# EAGLE design Motor (EAGLE 7.6.0)
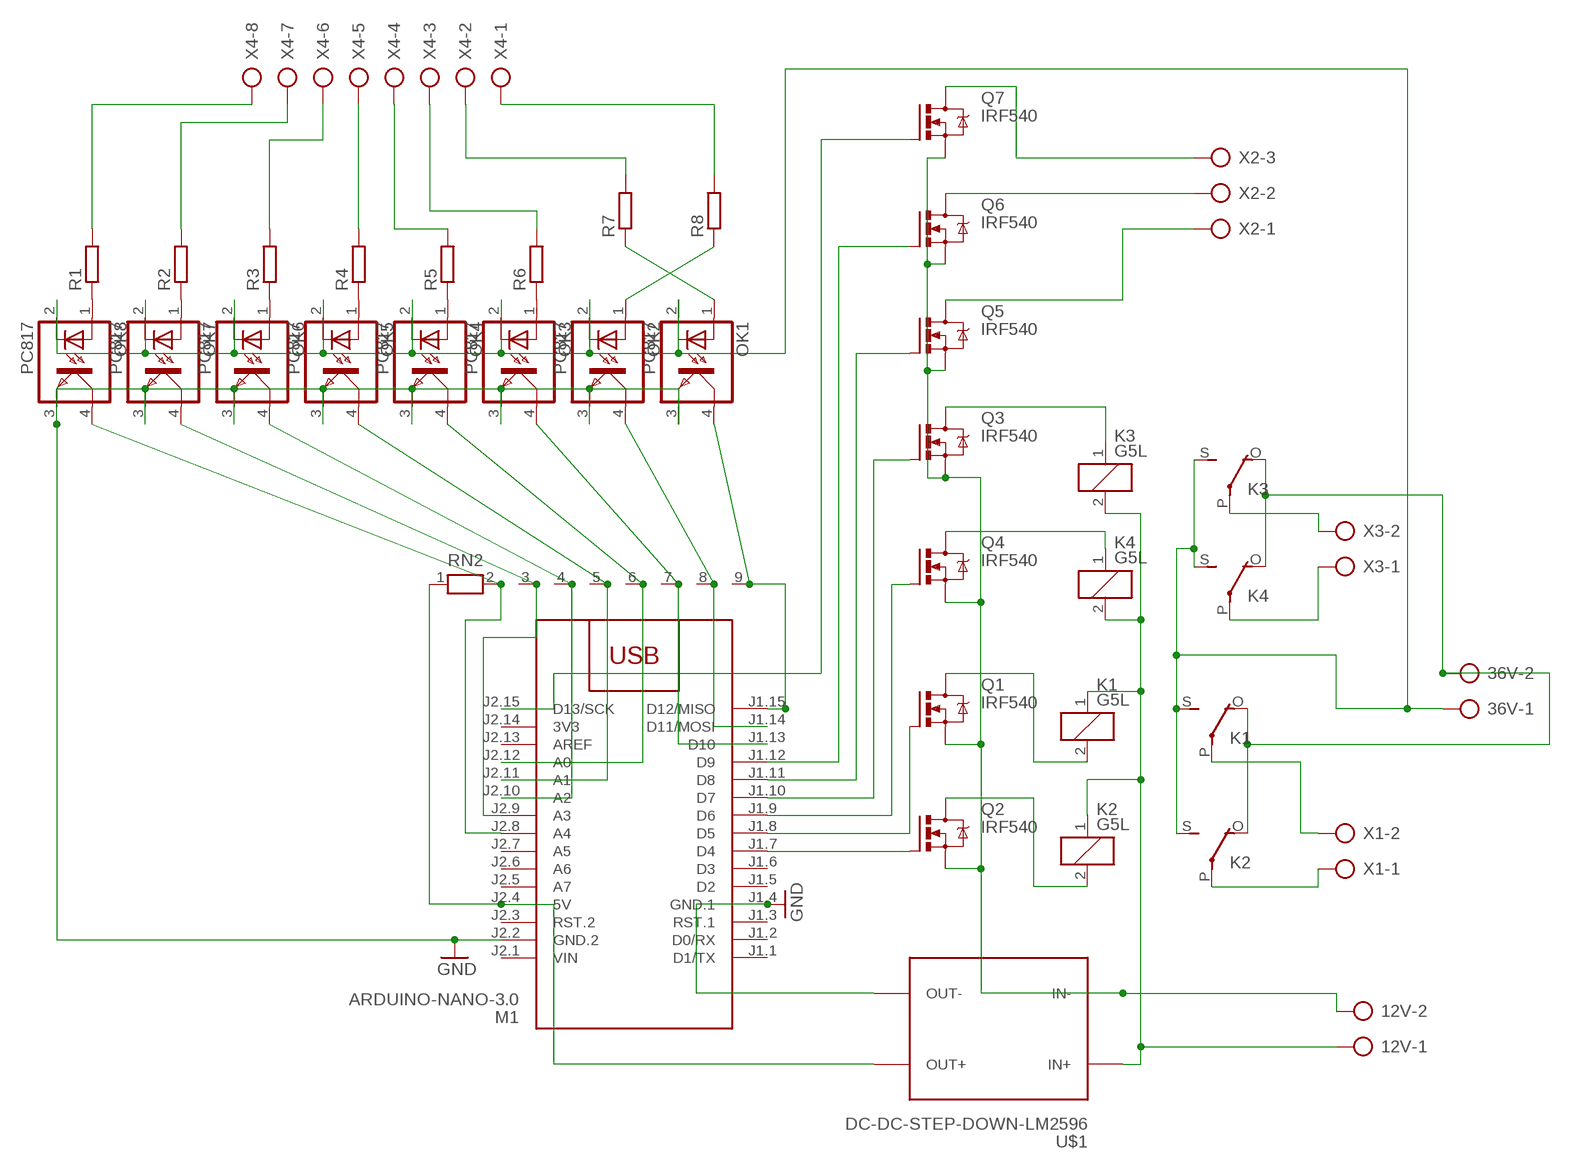
[diagram p0: schematic, sheet 1]

## Parts
12V  AK300/2  [AK300/2]
36V  AK300/2  [AK300/2]
K1  G5L  [G5LE]
K2  G5L  [G5LE]
K3  G5L  [G5LE]
K4  G5L  [G5LE]
M1  ARDUINO-NANO-3.0  [ARDUINO-NANO-3.0]
OK1  PC817  [DIL04]
OK2  PC817  [DIL04]
OK3  PC817  [DIL04]
OK4  PC817  [DIL04]
OK5  PC817  [DIL04]
OK6  PC817  [DIL04]
OK7  PC817  [DIL04]
OK8  PC817  [DIL04]
Q1  IRF540  [TO220BV]
Q2  IRF540  [TO220BV]
Q3  IRF540  [TO220BV]
Q4  IRF540  [TO220BV]
Q5  IRF540  [TO220BV]
Q6  IRF540  [TO220BV]
Q7  IRF540  [TO220BV]
R1  R-EU_0204/7  [0204/7]
R2  R-EU_0204/7  [0204/7]
R3  R-EU_0204/7  [0204/7]
R4  R-EU_0204/7  [0204/7]
R5  R-EU_0204/7  [0204/7]
R6  R-EU_0204/7  [0204/7]
R7  R-EU_0204/7  [0204/7]
R8  R-EU_0204/7  [0204/7]
RN2  RN08  [RN-9]
U$1  DC-DC-STEP-DOWN-LM2596  [DC-DC-STEP-DOWN-LM2596]
X1  AK300/2  [AK300/2]
X2  AK300/3  [AK300/3]
X3  AK300/2  [AK300/2]
X4  AK300/8  [AK300/8]

## Nets
+36V: 36V.2 K1.O(2:O) K2.O(2:O) K3.O(2:O) K4.O(2:O)
-36V: 36V.1 K1.S(2:S) K2.S(2:S) K3.S(2:S) K4.S(2:S) OK1.2(C) OK2.2(C) OK3.2(C) OK4.2(C) OK5.2(C) OK6.2(C) OK7.2(C) OK8.2(C)
GND: M1.J1.4(GND.1) M1.J2.2(GND.2) OK1.3(EMIT) OK2.3(EMIT) OK3.3(EMIT) OK4.3(EMIT) OK5.3(EMIT) OK6.3(EMIT) OK7.3(EMIT) OK8.3(EMIT) U$1.OUT-
GND12: 12V.2 Q1.S Q2.S Q3.S Q4.S Q5.S Q6.S Q7.S U$1.IN-
N$1: Q7.D X2.3
N$2: M1.J1.15(D12/MISO) OK1.4(COL) RN2.9
N$3: K2.2 Q2.D
N$4: K1.2 Q1.D
N$5: M1.J2.15(D13/SCK) Q7.G
N$6: M1.J2.4(5V) RN2.1 U$1.OUT+
N$8: M1.J1.7(D4) Q2.G
N$9: 12V.1 K1.1 K2.1 K3.2 K4.2 U$1.IN+
N$10: M1.J1.8(D5) Q1.G
N$11: K2.P(2:P) X1.1
N$12: K1.P(2:P) X1.2
N$13: Q5.D X2.1
N$14: OK2.1(A) R8.1
N$15: K3.P(2:P) X3.2
N$16: K4.P(2:P) X3.1
N$17: Q6.D X2.2
N$18: K3.1 Q3.D
N$19: K4.1 Q4.D
N$20: M1.J1.9(D6) Q4.G
N$21: M1.J1.10(D7) Q3.G
N$22: M1.J2.8(A4) OK8.4(COL) RN2.2
N$23: OK1.1(A) R7.1
N$24: M1.J1.11(D8) Q5.G
N$25: M1.J1.12(D9) Q6.G
N$26: M1.J2.10(A2) OK6.4(COL) RN2.4
N$27: M1.J2.11(A1) OK5.4(COL) RN2.5
N$28: M1.J2.12(A0) OK4.4(COL) RN2.6
N$29: M1.J2.9(A3) OK7.4(COL) RN2.3
N$33: OK8.1(A) R1.1
N$34: OK7.1(A) R2.1
N$35: OK6.1(A) R3.1
N$36: OK5.1(A) R4.1
N$37: OK4.1(A) R5.1
N$38: OK3.1(A) R6.1
N$42: R1.2 X4.8
N$43: R2.2 X4.7
N$44: R3.2 X4.6
N$45: R4.2 X4.5
N$46: R5.2 X4.4
N$47: R6.2 X4.3
N$48: R7.2 X4.2
N$49: R8.2 X4.1
N$52: M1.J1.13(D10) OK3.4(COL) RN2.7
N$53: M1.J1.14(D11/MOSI) OK2.4(COL) RN2.8
Unconnected: M1.J1.1(D1/TX) M1.J1.2(D0/RX) M1.J1.3(RST.1) M1.J1.5(D2) M1.J1.6(D3) M1.J2.3(RST.2) M1.J2.5(A7) M1.J2.6(A6) M1.J2.7(A5) M1.J2.13(AREF)

## Power pins joined to a net without a drawn wire
3V3: M1.J2.14(3V3)
VIN: M1.J2.1(VIN)

## Library data of the parts
12V 36V X1 X3 = con-ptr500:AK300/2: CONNECTOR; OC_FARNELL: unknown; OC_NEWARK: unknown
K1-K4 = relay:G5L: RELAY 1 x switch, 10 A/120 V AC, 8 A/30 V ADC, Omron; OC_FARNELL: unknown; OC_NEWARK: unknown
M1 = diy-modules:ARDUINO-NANO-3.0: Arduino Nano 3.0 and compatible devices More details available here: https://www.arduino.cc/en/Main/ArduinoBoardNano Click here to find device on ebay.com <http://www.ebay.com/sch/arduino+nano>
OK1-OK8 = optocoupler:PC817: SHARP OPTO COUPLER; MPN: PC817X4J000F; OC_FARNELL: 9707727; OC_NEWARK: 97K7059
Q1-Q7 = transistor-power:IRF540: HEXFET Power MOSFET
R1-R8 = rcl:R-EU_: RESISTOR, European symbol
RN2 = resistor-net:RN08: RESISTOR NETWORK; OC_FARNELL: unknown; OC_NEWARK: unknown
U$1 = diy-modules:DC-DC-STEP-DOWN-LM2596: DC/DC Step-Down Regulator based on LM2596-ADJ chip LM2596 datasheet available here: http://www.ti.com/lit/ds/symlink/lm2596.pdf Click here to find device on ebay.com <http://www.ebay.com/sch/lm2596+power+regulator>
X2 = con-ptr500:AK300/3: CONNECTOR; OC_FARNELL: unknown; OC_NEWARK: unknown
X4 = con-ptr500:AK300/8: CONNECTOR; OC_FARNELL: unknown; OC_NEWARK: unknown

## Board
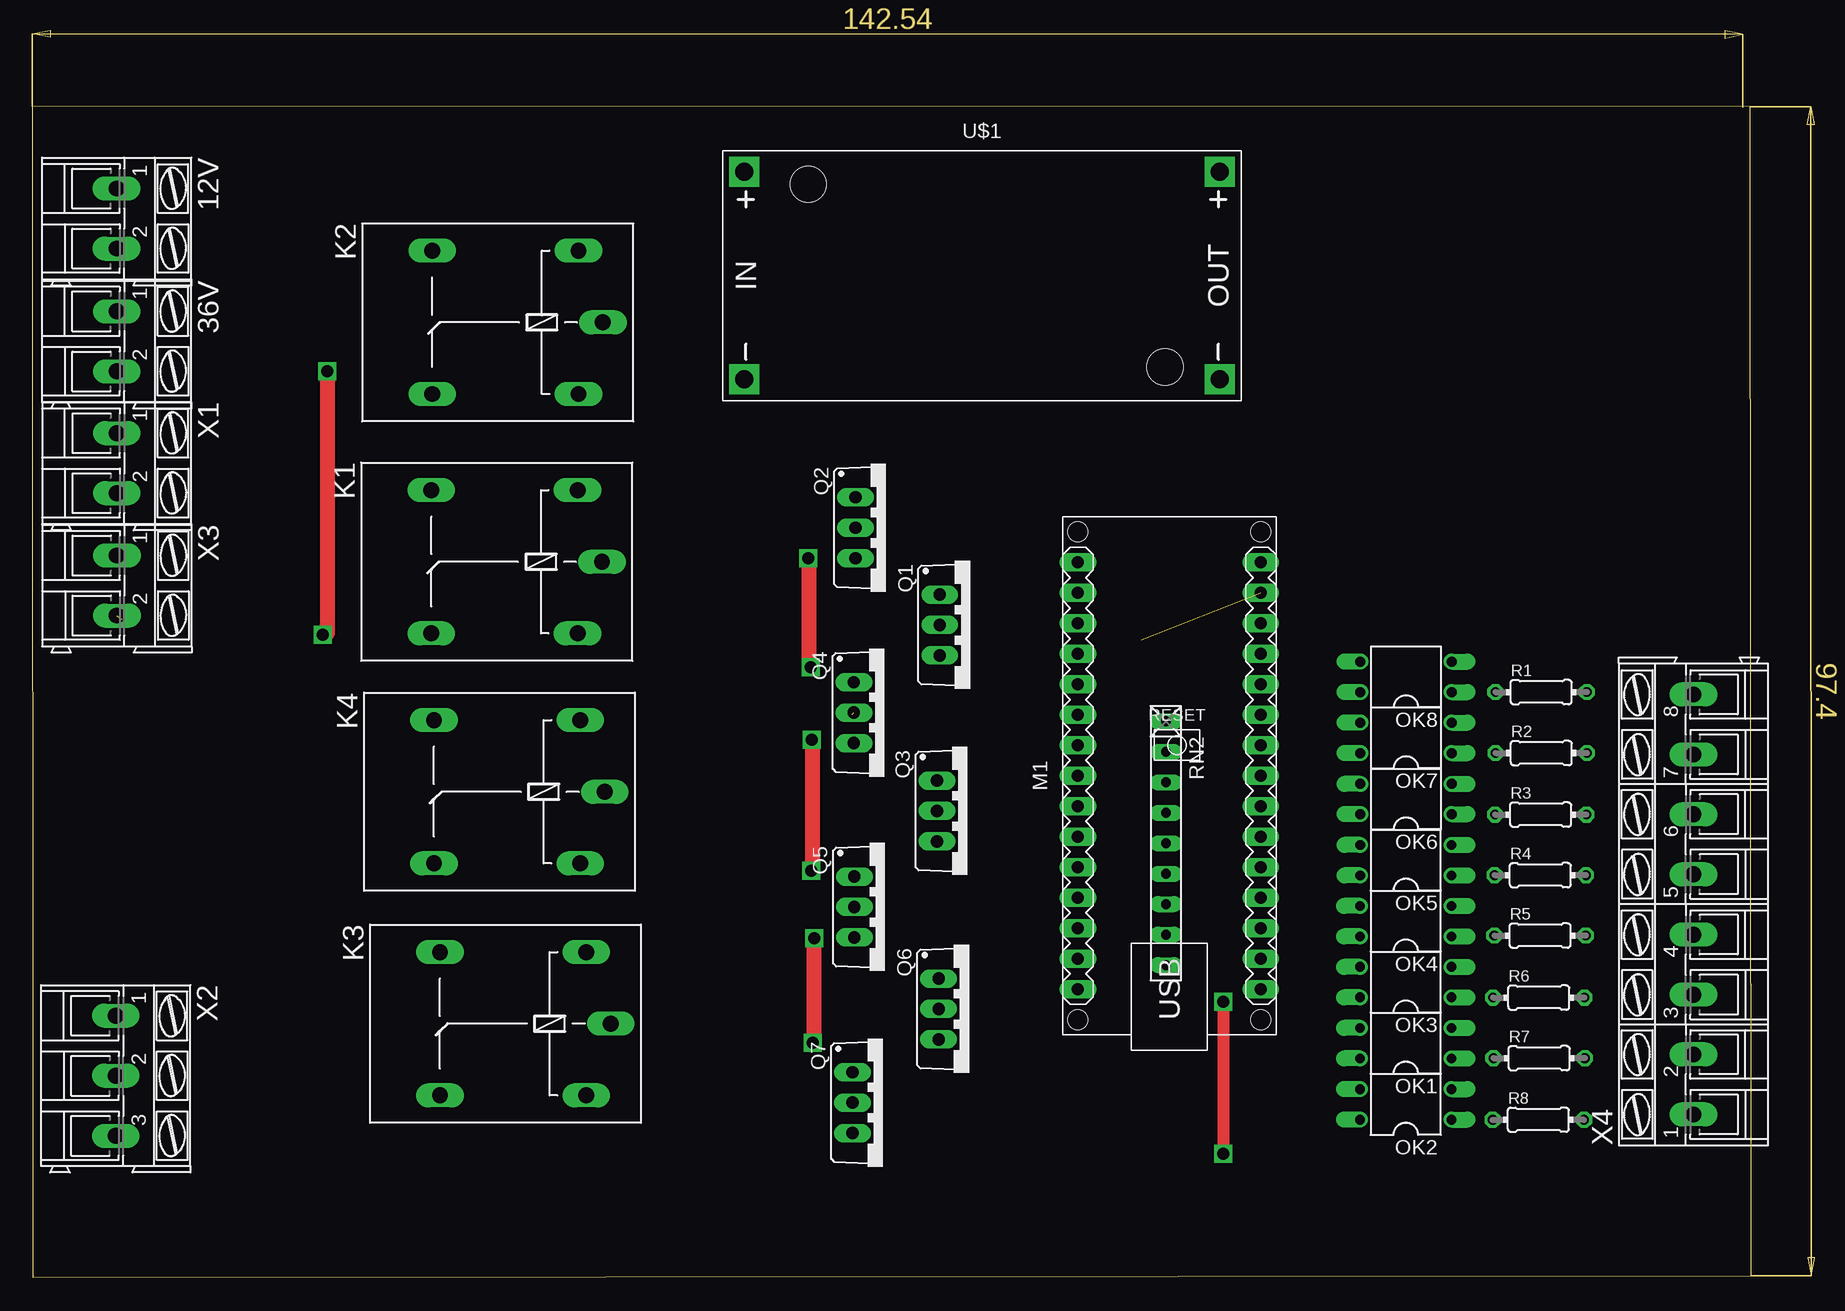
[diagram p1: board, top side]
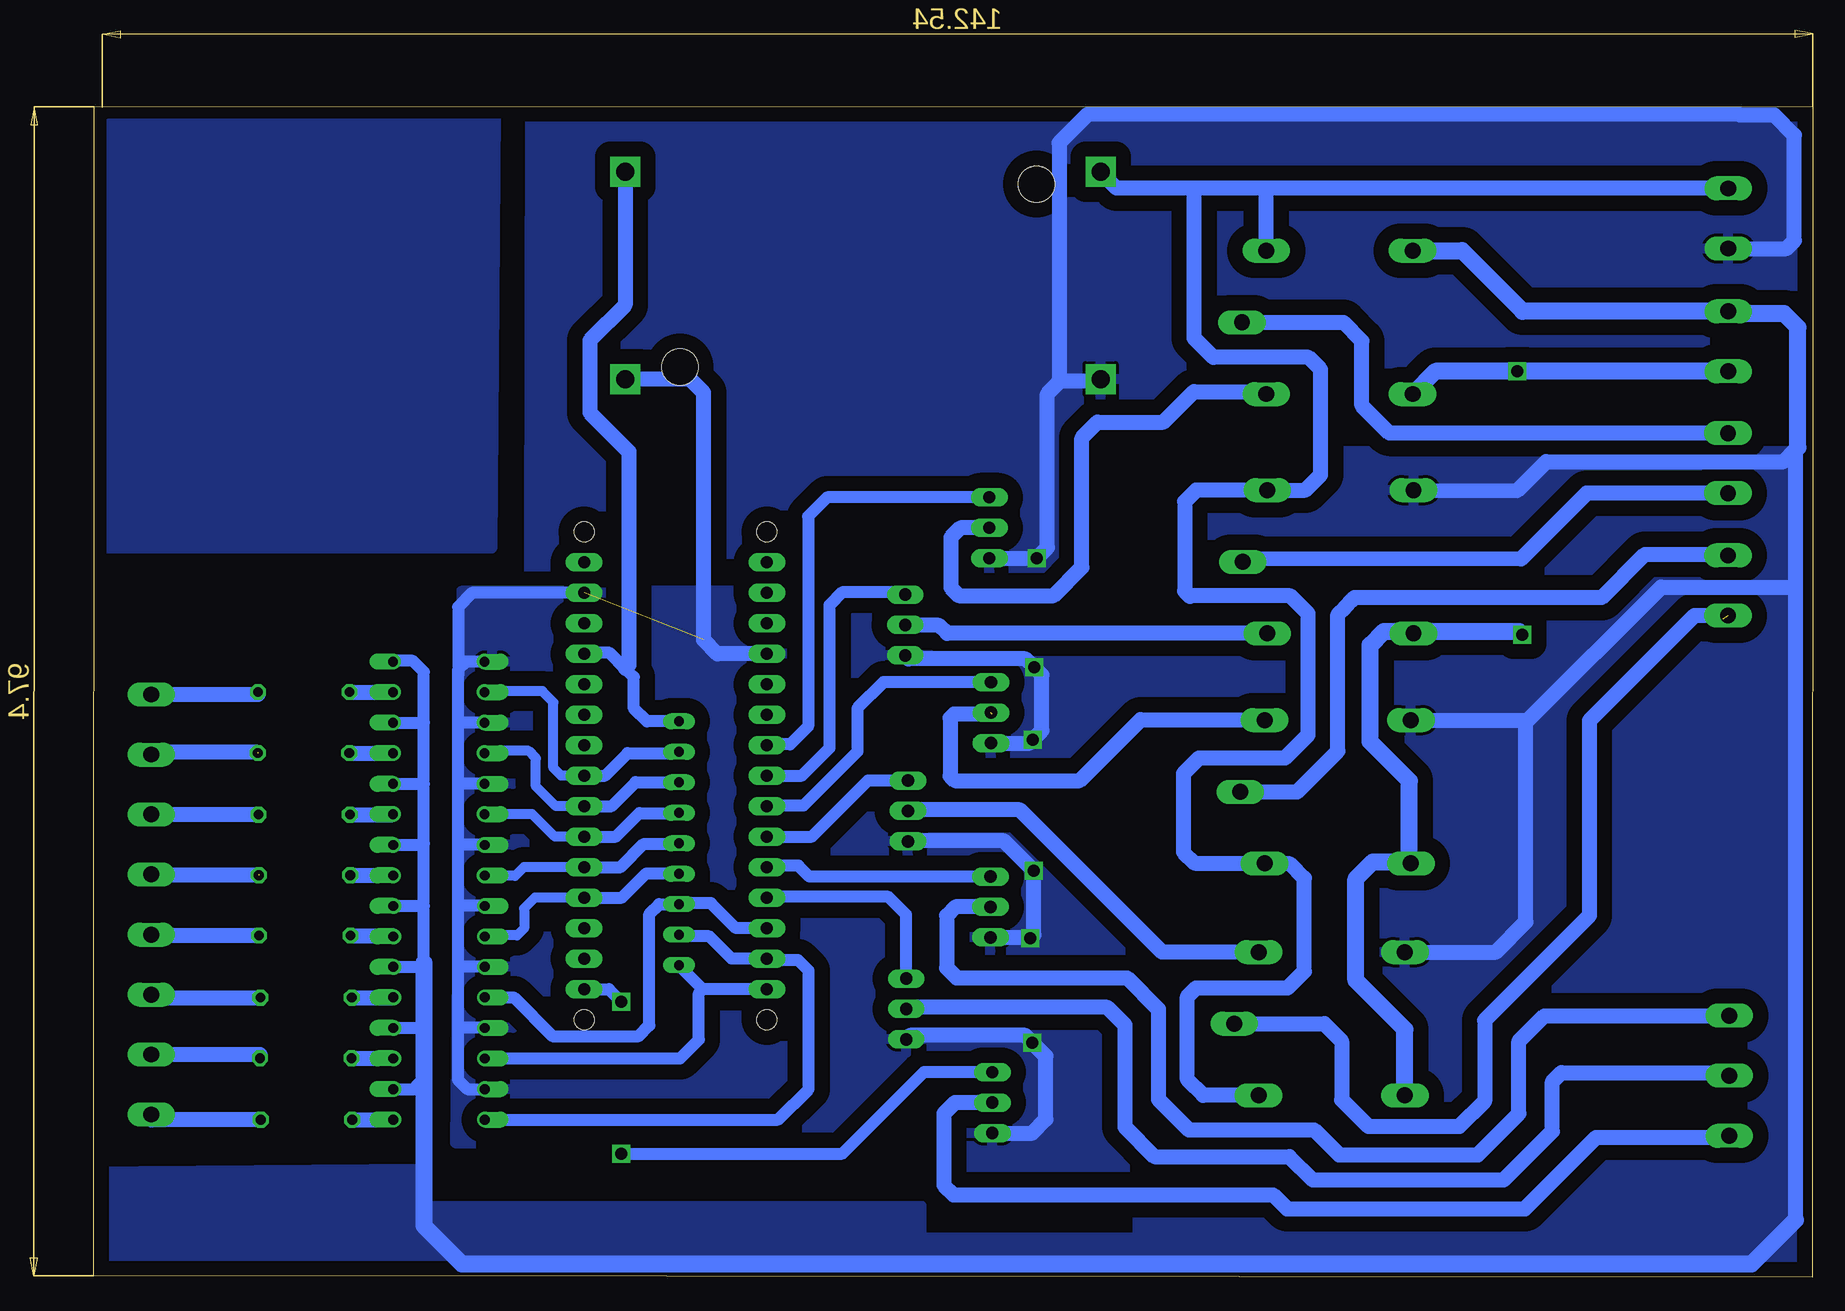
[diagram p2: board, bottom side, seen from below]

Size 143.23 x 97.57 mm. Coordinates in mm from the lower left corner, seen from the top.
Outline: 0.05,0 143.23,0.13 143.18,97.53 0,97.57 0.05,0
Copper layers (1*16): Top 0.035mm / dielectric 1.5mm / Bottom 0.035mm
Design rules "default": minimum track width 10mil, minimum drill 24mil, track to track 8mil, track to pad 8mil, pad to pad 8mil, via to via 8mil, smd to smd 8mil, copper to edge 40mil, drill to drill 8mil, minimum pad ring 10mil, minimum via ring 8mil, stop-mask expansion 4mil, vias tented up to drill 0mil, thermal gap 10mil

### Footprints (pad centres in the part's own frame; a part is rotated, then mirrored left to right if it is on the bottom)
AK300/2 = drill 1.321 long: 1 -2.515,0; 2 2.489,0
G5LE = drill 1.321 long: 1 -7.493,-5.969; 2 -7.493,5.969; O 4.699,5.969; P -9.525,0; S 4.699,-5.969
ARDUINO-NANO-3.0 = drill 1 pad 1.524 long: J1.1 17.78,7.62; J1.2 15.24,7.62; J1.3 12.7,7.62; J1.4 10.16,7.62; J1.5 7.62,7.62; J1.6 5.08,7.62; J1.7 2.54,7.62; J1.8 0,7.62; J1.9 -2.54,7.62; J1.10 -5.08,7.62; J1.11 -7.62,7.62; J1.12 -10.16,7.62; J1.13 -12.7,7.62; J1.14 -15.24,7.62; J1.15 -17.78,7.62; J2.1 17.78,-7.62; J2.2 15.24,-7.62; J2.3 12.7,-7.62; J2.4 10.16,-7.62; J2.5 7.62,-7.62; J2.6 5.08,-7.62; J2.7 2.54,-7.62; J2.8 0,-7.62; J2.9 -2.54,-7.62; J2.10 -5.08,-7.62; J2.11 -7.62,-7.62; J2.12 -10.16,-7.62; J2.13 -12.7,-7.62; J2.14 -15.24,-7.62; J2.15 -17.78,-7.62 | hole 1.651: -20.32,7.62; -20.32,-7.62; 20.32,-7.62; 20.32,7.62
DIL04 = drill 0.813 offset: 1 -1.27,-3.81; 2 1.27,-3.81; 3 1.27,3.81; 4 -1.27,3.81
TO220BV = drill 1.016 long: D 0,-2.54; G -2.54,-2.54; S 2.54,-2.54
0204/7 = drill 0.813 octagon: 1 -3.81,0; 2 3.81,0
RN-9 = drill 0.813 long: 1 -10.16,0; 2 -7.62,0; 3 -5.08,0; 4 -2.54,0; 5 0,0; 6 2.54,0; 7 5.08,0; 8 7.62,0; 9 10.16,0
DC-DC-STEP-DOWN-LM2596 = drill 1.5 pad 2.5 square: IN+ -19.812,8.636; IN- -19.812,-8.636; OUT+ 19.812,8.636; OUT- 19.812,-8.636 | hole 3: -14.478,7.62; 15.24,-7.62
AK300/3 = drill 1.321 long: 1 -5.004,0; 2 0,0; 3 5.004,0
AK300/8 = drill 1.321 long: 1 -17.501,0; 2 -12.497,0; 3 -7.518,0; 4 -2.515,0; 5 2.515,0; 6 7.518,0; 7 12.497,0; 8 17.501,0

### Placement (x,y rotation side)
12V  7.03,88.21 270 top
36V  7.03,77.98 270 top
K1  37.95,59.62 180 top
K2  38.03,79.57 180 top
K3  38.67,21.12 180 top
K4  38.17,40.45 180 top
M1  94.76,41.79 90 top
OK1  114.46,19.5 90 top
OK2  114.46,14.4 90 top
OK3  114.46,24.59 90 top
OK4  114.46,29.67 90 top
OK5  114.47,34.75 90 top
OK6  114.48,39.85 90 top
OK7  114.48,44.94 90 top
OK8  114.48,50.02 90 top
Q1  78.16,54.35 270 top
Q2  71.14,62.45 270 top
Q3  77.93,38.85 270 top
Q4  71.01,47.05 270 top
Q5  71.05,30.85 270 top
Q6  78.07,22.35 270 top
Q7  70.89,14.55 270 top
R1  125.74,48.76 0 top
R2  125.75,43.68 0 top
R3  125.7,38.55 0 top
R4  125.67,33.5 0 top
R5  125.65,28.47 0 top
R6  125.54,23.3 0 top
R7  125.57,18.25 0 top
R8  125.51,13.12 0 top
RN2  94.47,36.16 270 top
U$1  79.15,83.47 0 top
X1  7.04,67.83 270 top
X2  6.95,16.79 270 top
X3  7.05,57.63 270 top
X4  138.44,31.06 90 top

### Tracks (layer width: path | path; a pad name or v marks a point on that pad's centre or on a via)
+36V  (via drill 1)
  Top 1.27: v24.2,53.53 24.46,53.53 24.62,53.69 24.62,75.47 v24.6,75.49
  Bottom 1.27: 33.6,34.61 K4.O | 33.41,53.81 K1.O | 24.48,53.81 v24.2,53.53 | v24.6,75.49 24.11,75.49
  Bottom 1.422: 36V.2 24.11,75.49 | v24.6,75.49 31.44,75.49 K2.O | K3.O 33.98,20.65 38.06,24.73 38.06,33.19 36.64,34.61 33.6,34.61 33.6,41.36 36.87,44.63 36.87,52.67 35.73,53.81 33.41,53.81 24.48,53.81
-36V
  Bottom 1.016: OK2.2 116.45,15.67 115.91,16.21 115.72,16.4 115.72,20.84 | 115.72,20.84 115.72,26.19 | 115.72,26.19 115.72,30.94 | 115.72,30.94 115.72,36.16 | 115.72,36.16 115.72,41.11 | 115.72,41.11 115.72,46.23 | 115.72,46.23 115.72,50.44 116.65,51.37 118.21,51.37 OK8.2 | OK7.2 115.74,46.21 115.72,46.23 | OK6.2 115.73,41.12 115.72,41.11 | OK5.2 115.86,36.02 115.72,36.16 | OK4.2 115.72,30.94 | OK3.2 116.05,25.86 115.72,26.19 | OK1.2 115.79,20.77 115.72,20.84
  Bottom 1.27: K1.S 24.62,65.56 22.21,67.96 2.42,67.96 1.44,68.94 | 1.44,68.94 1.23,69.15 | 6.84,80.3 36V.1 | K4.S 23.74,46.39 | 23.74,46.39 12.61,57.52 1.57,57.52 1.44,57.39 | K3.S 26.4,27.09 23.89,29.6 23.89,46.24 23.74,46.39 | 1.44,68.94 1.44,57.39 | 1.44,57.39 1.44,4.76 | 116.2,15.92 115.91,16.21
  Bottom 1.422: 36V.1 24.16,80.49 29.2,85.54 K2.S | 1.23,69.15 1.23,79.16 2.38,80.3 6.84,80.3 | 115.72,26.19 115.72,4.29 112.55,1.12 5.08,1.12 1.44,4.76
  pour Bottom (isolate 1.27): 0.11,56.16 0.11,-1.71 144.47,-1.71 144.29,8.81 115.5,9.08 115.6,5.97 74.26,5.97 74.26,3.34 56.25,3.34 56.25,68.87 0.12,68.87 0.12,55.98
A
  pour Bottom: 109.76,97.23 109.73,97.23 110.03,60.71 143.12,60.71 143.11,97.38 109.71,97.38
GND  (1 unrouted)
  Bottom 1.016: 112.89,50.1 112.89,50.6 112.2,51.29 OK8.3 110.62,51.24 | 112.89,50.1 112.89,46.3 | 112.89,46.3 112.89,41.42 | 112.89,41.42 112.89,35.85 | 112.89,35.85 112.89,31.03 | 112.89,31.03 112.89,25.69 | 112.89,25.69 112.89,20.7 | 112.89,20.7 112.89,16.46 112.11,15.68 OK2.3 | OK7.3 112.8,46.21 112.89,46.3 | OK6.3 112.59,41.12 112.89,41.42 | OK5.3 112.72,36.02 112.89,35.85 | OK4.3 112.8,30.94 112.89,31.03 | OK3.3 112.72,25.86 112.89,25.69 | OK1.3 112.82,20.77 112.89,20.7 | M1.J2.2 111.72,57.03 112.88,55.87 112.88,50.11 112.89,50.1
  Bottom 1.27: M1.J1.4 91.26,51.95 92.42,53.11 92.42,73.71 93.53,74.82 98.95,74.82 U$1.OUT-
  pour Bottom (isolate 1.27): 85.2,57.2 112.62,57.2 113.14,11.17 85.69,11.17
GND12  (via drill 1)
  Top 1.27: v64.66,59.91 64.68,59.91 64.72,59.88 64.72,50.98 v64.87,50.82 | v64.98,44.77 64.98,44.82 65,44.84 65,33.97 v64.9,33.87 | v65.17,28.26 65.17,28.3 65.14,28.33 65.14,19.68 v65.02,19.56
  Bottom 1.27: Q7.S 65.03,12.01 63.88,13.15 63.88,18.42 v65.02,19.56 65.61,20.14 75.2,20.14 Q6.S | Q5.S 65.13,28.31 | Q3.S 75.33,36.37 67.4,36.37 v64.9,33.87 64.9,28.54 65.12,28.31 65.13,28.31 | Q1.S 75.34,51.54 65.59,51.54 v64.87,50.82 64.23,50.17 64.23,45.54 65.26,44.51 Q4.S 65.24,44.51 v64.98,44.77 | Q2.S v64.66,59.91 63.78,60.79 63.78,73.61 62.7,74.69 | 62.7,74.69 62.67,74.72 59.45,74.72 U$1.IN- | 62.7,74.69 62.79,74.79 62.79,94.53 60.41,96.91 6.07,96.88 6.03,96.84 3.17,96.84 1.51,95.18 1.51,86.39 2.18,85.72 12V.2 | 65.13,28.31 v65.17,28.26
  pour Bottom (isolate 1.27): 55.62,97.98 106.9,97.98 107.11,2.55 0.3,3.29 -0.66,98.29
N$1
  Bottom 1.27: Q7.D 71.48,14.55 72.4,13.63 72.4,7.68 71.59,6.87 44.95,6.87 43.78,5.7 23.98,5.7 18.03,11.65 7.09,11.65 X2.3
N$2
  Bottom 1.016: M1.J1.15 92.48,24.01 | 92.48,24.01 RN2.9 | OK1.4 94.37,18.23 92.81,19.79 92.81,23.68 92.48,24.01
N$3
  Bottom 1.27: 45.58,73.55 K2.2 45.73,73.81 51.55,73.81 54.1,71.26 59.59,71.26 60.9,69.95 60.9,59.16 63.26,56.8 71.17,56.8 71.82,57.46 71.82,61.64 71.01,62.45 Q2.D
N$4
  Bottom 1.27: K1.2 72.13,53.65 72.8,54.32 75.59,54.32 Q1.D
N$5  (via drill 1)
  Top 1.016: 99.26,23.07 v99.26,22.96 v99.26,10.3
  Bottom 1.016: Q7.G 74.07,17.09 80.86,10.3 v99.26,10.3 | M1.J2.15 100.31,24.01 v99.26,22.96
N$6
  Bottom 1.016: RN2.1 97.15,46.32 98.22,47.39 98.22,50 98.93,50.72 100.25,52.03 102.3,52.03 M1.J2.4
  Bottom 1.27: U$1.OUT+ 98.96,81 101.9,78.06 101.9,72.05 98.64,68.79 98.64,51.01 98.93,50.72
N$8
  Bottom 1.016: Q2.G 82.12,64.99 83.71,63.4 83.71,45.9 85.21,44.4 87.07,44.4 M1.J1.7
N$9
  Bottom 1.27: 12V.1 45.34,90.76 | 45.34,90.76 51.82,90.76 | 51.82,90.76 57.99,90.76 U$1.IN+ | K2.1 45.52,90.58 45.34,90.76 | 51.82,90.76 51.53,90.47 51.53,78.25 49.93,76.65 42,76.65 41,75.64 41,66.86 42.27,65.59 K1.1 51.36,65.59 52.33,64.62 52.33,57.18 51.87,56.72 51.8,56.78 43.52,56.78 42.04,55.3 42.04,45.2 43.96,43.28 51.12,43.28 52.43,41.96 52.43,35.43 51.5,34.5 45.68,34.5 K4.2 45.63,34.45 43.54,34.45 42.35,33.26 42.35,25.49 43.74,24.1 51.38,24.1 52.11,23.38 52.11,16.46 50.8,15.15 K3.2
N$10
  Bottom 1.016: M1.J1.8 84.22,41.79 81.91,44.1 81.91,56 80.81,57.1 75.83,57.1 Q1.G
N$11
  Bottom 1.27: X1.1 35.26,70.34 37.55,72.63 37.55,78.01 39.11,79.57 K2.P
N$12
  Bottom 1.27: X1.2 18.82,65.34 24.31,59.85 47.22,59.88 K1.P
N$13
  Bottom 1.27: Q5.D 71.44,30.85 72.16,30.13 72.16,25.77 71.34,24.95 57.13,24.95 54.51,22.33 54.51,14.82 51.97,12.28 41.53,12.28 39.45,10.2 27.9,10.2 24.47,13.63 24.47,19.67 22.36,21.78 6.96,21.78 X2.1
N$14
  Bottom 1.27: R8.1 OK2.1
N$15  (1 unrouted)
  Bottom 1.27: K3.P 40.69,21.12 39.24,19.67 39.24,14.78 37.02,12.56 29.43,12.56 27.33,14.66 27.33,21.4 18.6,30.13 18.6,46.38 9.84,55.14 X3.2 | 7.53,54.87 7.47,54.81
N$16
  Bottom 1.27: X3.1 7.14,60.24 13.97,60.24 17.57,56.63 38.18,56.63 38.36,56.45 38.96,55.85 39.57,55.24 39.57,43.83 42.95,40.45 K4.P
N$17
  Bottom 1.27: Q6.D 75.4,22.48 58.78,22.48 57.32,21.02 57.32,12.52 54.85,10.05 43.6,10.05 41.65,8.1 25.75,8.1 21.69,12.16 21.69,16.29 20.94,17.04 7.2,17.04 X2.2
N$18
  Bottom 1.27: K3.1 54.2,27.09 66.07,38.95 75.29,38.95 Q3.D
N$19  (1 unrouted)
  Bottom 1.27: 68.35,46.93 71.55,46.93 71.87,46.6 71.87,41.77 71.48,41.37 61.09,41.37 55.99,46.47 45.72,46.47 K4.1
N$20
  Bottom 1.016: Q4.G 77.42,49.59 79.61,47.4 79.61,43.8 84.11,39.3 87.09,39.3 M1.J1.9
N$21
  Bottom 1.016: M1.J1.10 83.4,36.71 78.71,41.4 Q3.G
N$22
  Bottom 0.813: M1.J2.8 104.29,41.79 104.94,42.44 104.94,47.91 105.86,48.83 110.59,48.83 OK8.4
  Bottom 1.016: M1.J2.8 100.62,41.79 98.74,43.67 94.58,43.67 RN2.2
N$23
  Bottom 1.27: R7.1 118.29,18.25 OK1.1
N$24
  Bottom 1.016: Q5.G 83.6,33.39 84.51,34.3 87.01,34.3 M1.J1.11
N$25
  Bottom 1.016: Q6.G 75.53,30.22 77.01,31.7 87.07,31.7 M1.J1.12
N$26
  Bottom 0.813: M1.J2.10 104.82,36.71 106.7,38.59 OK6.4
  Bottom 1.016: M1.J2.10 99.73,36.71 97.77,38.67 94.5,38.67 RN2.4
N$27
  Bottom 0.813: M1.J2.11 107.39,34.17 108.12,33.44 110.62,33.44 OK5.4
  Bottom 1.016: M1.J2.11 99.33,34.17 97.39,36.11 94.52,36.11 RN2.5
N$28
  Bottom 0.813: M1.J2.12 106.47,31.63 107.37,30.73 107.37,29.07 107.95,28.49 110.56,28.49 OK4.4
  Bottom 1.016: M1.J2.12 99.22,31.63 97.19,33.66 94.51,33.66 RN2.6
N$29
  Bottom 0.813: M1.J2.9 104.73,39.25 106.39,40.91 106.39,43.24 107,43.85 110.49,43.85 OK7.4
  Bottom 1.016: M1.J2.9 100.08,39.25 98.08,41.25 RN2.3
N$33
  Bottom 1.27: R1.1 OK8.1
N$34
  Bottom 1.27: R2.1 OK7.1
N$35
  Bottom 1.27: R3.1 118.32,38.55 OK6.1
N$36
  Bottom 1.27: R4.1 118.3,33.5 OK5.1
N$37
  Bottom 1.27: R5.1 118.34,28.47 OK4.1
N$38
  Bottom 1.27: R6.1 118.29,23.3 OK3.1
N$42
  Bottom 1.27: X4.8 129.55,48.56 R1.2
N$43  (1 unrouted)
  Bottom 1.27: 129.56,43.73 138.44,43.73 X4.7
N$44
  Bottom 1.27: X4.6 129.51,38.58 R3.2
N$45  (1 unrouted)
  Bottom 1.27: R4.2 138.44,33.5 X4.5
N$46
  Bottom 1.27: R5.2 138.44,28.47 X4.4
N$47
  Bottom 1.27: X4.3 138.15,23.54 138.15,23.28 129.35,23.28 R6.2
N$48
  Bottom 1.27: X4.2 129.38,18.56 R7.2
N$49
  Bottom 1.27: R8.2 138.44,13.12 X4.1
N$52
  Bottom 1.016: M1.J1.13 89.73,29.09 91.81,31.17 94.38,31.17 RN2.7 96.12,31.09 96.93,30.28 96.93,20.98 97.82,20.09 105.02,20.09 108.25,23.32 OK3.4
N$53
  Bottom 1.016: RN2.8 94.34,28.41 91.94,28.41 90.08,26.55 M1.J1.14 87.01,26.42 84.54,26.42 83.67,25.55 83.67,15.68 86.22,13.13 OK2.4